# Altium project Receiver_STC12C5608AD.PrjPcb
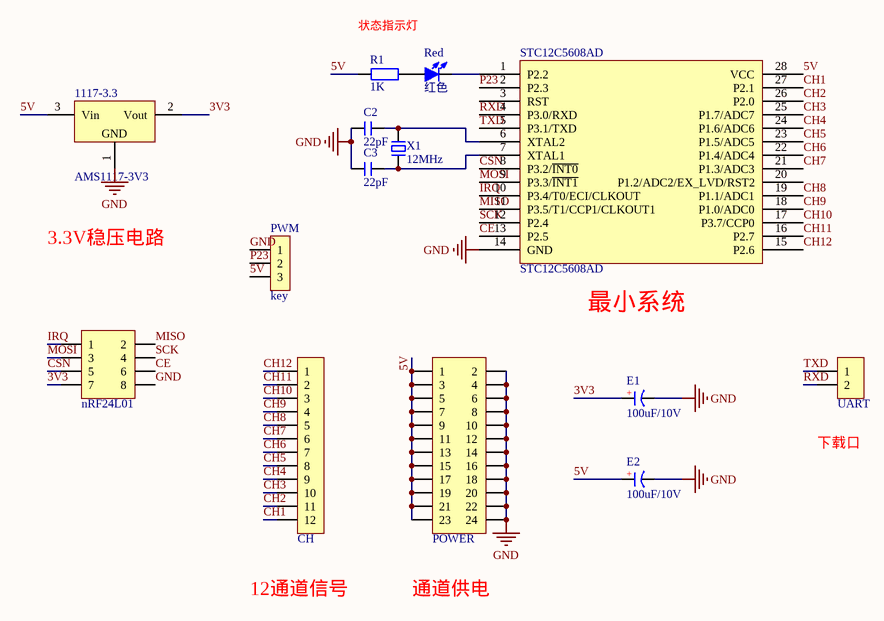
[diagram p0: Receiver_STC12C5608AD.SchDoc]
1 sheet, 14 parts. Net scope: global (net labels, ports and power ports of the same name join across sheets).
Board file: Receiver_STC12C5608AD.PcbDoc

## Sheet Receiver_STC12C5608AD.SchDoc
size A4

### Parts
1117-3.3  AMS1117-3V3  [SOT223_L]
C2  22pF  [C 0603]
C3  22pF  [C 0603]
CH  HDR-1X12  [HDR-1X12]  (value not drawn)
E1  100uF/10V  [CD C(6032)]
E2  100uF/10V  [CD C(6032)]
nRF24L01  Header 4X2  [HDR-4X2]  (value not drawn)
POWER  Header 2X11  [HDR-12X2]  (value not drawn)
PWM  key  [HDR-1X3]
R1  1K  [R 0603]
Red  红色  [LED 0603R]
STC12C5608AD  STC12C5608AD  [SOP28_N]
UART  HDR-1X2  [HDR-1X2]  (value not drawn)
X1  12MHz  [XTAL-49S DIP]

### Nets
GND: 1117-3.3.1(GND) C2.1 C3.1 E1.2(K) E2.2(K) nRF24L01.8 POWER.2 POWER.4 POWER.6 POWER.8 POWER.10 POWER.12 POWER.14 POWER.16 POWER.18 POWER.20 POWER.22 POWER.24 PWM.1 STC12C5608AD.14(GND)
3V3: 1117-3.3.2(Vout) E1.1(A) nRF24L01.7
5V: 1117-3.3.3(Vin) E2.1(A) POWER.1 POWER.3 POWER.5 POWER.7 POWER.9 POWER.11 POWER.13 POWER.15 POWER.17 POWER.19 POWER.21 POWER.23 PWM.3 R1.1 STC12C5608AD.28(VCC)
CE: nRF24L01.6 STC12C5608AD.13(P2.5)
CH1: CH.12 STC12C5608AD.27(P2.1)
CH2: CH.11 STC12C5608AD.26(P2.0)
CH3: CH.10 STC12C5608AD.25(P1.7/ADC7)
CH4: CH.9 STC12C5608AD.24(P1.6/ADC6)
CH5: CH.8 STC12C5608AD.23(P1.5/ADC5)
CH6: CH.7 STC12C5608AD.22(P1.4/ADC4)
CH7: CH.6 STC12C5608AD.21(P1.3/ADC3)
CH8: CH.5 STC12C5608AD.19(P1.1/ADC1)
CH9: CH.4 STC12C5608AD.18(P1.0/ADC0)
CH10: CH.3 STC12C5608AD.17(P3.7/CCP0)
CH11: CH.2 STC12C5608AD.16(P2.7)
CH12: CH.1 STC12C5608AD.15(P2.6)
CSN: nRF24L01.5 STC12C5608AD.8(P3.2/~{INT0})
IRQ: nRF24L01.1 STC12C5608AD.10(P3.4/T0/ECI/CLKOUT)
MISO: nRF24L01.2 STC12C5608AD.11(P3.5/T1/CCP1/CLKOUT1)
MOSI: nRF24L01.3 STC12C5608AD.9(P3.3/~{INT1})
P23: PWM.2 STC12C5608AD.2(P2.3)
RXD: STC12C5608AD.4(P3.0/RXD) UART.2
SCK: nRF24L01.4 STC12C5608AD.12(P2.4)
TXD: STC12C5608AD.5(P3.1/TXD) UART.1
NetC2_2: C2.2 STC12C5608AD.6(XTAL2) X1.2
NetC3_2: C3.2 STC12C5608AD.7(XTAL1) X1.1
NetR1_2: R1.2 Red.1(A)
NetRed_2: Red.2(K) STC12C5608AD.1(P2.2)

Not connected (* = marked no-connect by the designer): STC12C5608AD 3(RST) 20(P1.2/ADC2/EX_LVD/RST2)

### Notes on the sheet
- 状态指示灯
- 3.3V稳压电路
- (near STC12C5608AD) 最小系统
- (near UART) 下载口
- 12通道信号
- 通道供电
- (in symbol C-CD) +

### Library data of the parts
1117-3.3 = AMS1117: 三端稳压芯片; BOM名称: 稳压芯片; 版权归属: 源创客; 学习资源: www.ooocke.com
C2 C3 = C: 无极性贴片电容; 版权归属: 源创客; BOM名称: 无极性贴片电容; 学习资源: www.ooocke.com
CH = Header 12: 12P接插件; 版权归属: 源创客; BOM名称: 12P接插件; 学习资源: www.ooocke.com
E1 E2 = C-CD: 贴片钽电容; 版权归属: 源创客; BOM名称: 贴片钽电容; 学习资源: www.ooocke.com
nRF24L01 = Header 4X2: 4*2P接插件; 版权归属: 源创客; BOM名称: 4*2P接插件; 学习资源: www.ooocke.com
POWER = Header 12X2: 12*2P接插件; 版权归属: 源创客; BOM名称: 12*2P接插件; 学习资源: www.ooocke.com
R1 = R: 贴片电阻; 版权归属: 源创客; BOM名称: 贴片电阻; 学习资源: www.ooocke.com
Red = LED-SMD: 贴片LED; 版权归属: 源创客; BOM名称: 贴片LED; 学习资源: www.ooocke.com
STC12C5608AD = STC12C520xAD-28pin: STC带AD单片机; 版权归属: 源创客; BOM名称: STC带AD单片机; 学习资源: www.ooocke.com
UART = Header 2: 2P接插件; 版权归属: 源创客; BOM名称: 2P接插件; 学习资源: www.ooocke.com
X1 = XTAL-2: 2脚晶振; 版权归属: 源创客; BOM名称: 2脚晶振; 学习资源: www.ooocke.com